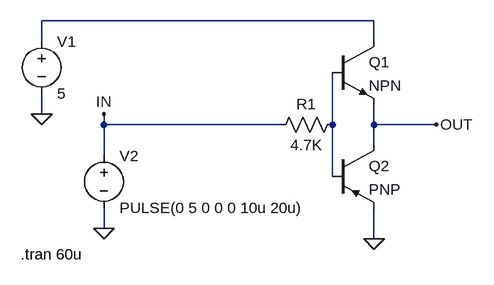
[diagram p0: schematic v1.0.asc]
v1.0.asc, the LTspice schematic file:
Version 4.1
SHEET 1 880 680
WIRE 384 32 -128 32
WIRE -128 64 -128 32
WIRE 384 64 384 32
WIRE -128 176 -128 144
WIRE -32 192 -32 176
WIRE 240 192 -32 192
WIRE 320 192 320 112
WIRE 384 192 384 160
WIRE 480 192 384 192
WIRE 384 224 384 192
WIRE -32 240 -32 192
WIRE 320 272 320 192
WIRE -32 352 -32 320
WIRE 384 368 384 320
FLAG -128 176 0
FLAG 384 368 0
FLAG 480 192 OUT
FLAG -32 352 0
FLAG -32 176 IN
SYMBOL npn 320 64 R0
SYMATTR InstName Q1
SYMBOL pnp 320 224 R0
SYMATTR InstName Q2
SYMBOL voltage -128 48 R0
WINDOW 123 0 0 Left 0
WINDOW 39 0 0 Left 0
SYMATTR InstName V1
SYMATTR Value 5
SYMBOL res 336 176 R90
WINDOW 0 0 56 VBottom 2
WINDOW 3 32 56 VTop 2
SYMATTR InstName R1
SYMATTR Value 4.7K
SYMBOL voltage -32 224 R0
WINDOW 123 0 0 Left 0
WINDOW 39 0 0 Left 0
SYMATTR InstName V2
SYMATTR Value PULSE(0 5 0 0 0 10u 20u)
TEXT -160 392 Left 2 !.tran 60u

The netlist it stands for:
* v1.0.asc
Q1 N001 N002 OUT 0 NPN
Q2 OUT N002 0 0 PNP
V1 N001 0 5
R1 N002 IN 4.7K
V2 IN 0 PULSE(0 5 0 0 0 10u 20u)
.model NPN NPN
.model PNP PNP
.lib standard.bjt
.tran 60u
.backanno
.end